# EAGLE design pedalBoard (EAGLE 9.6.2)
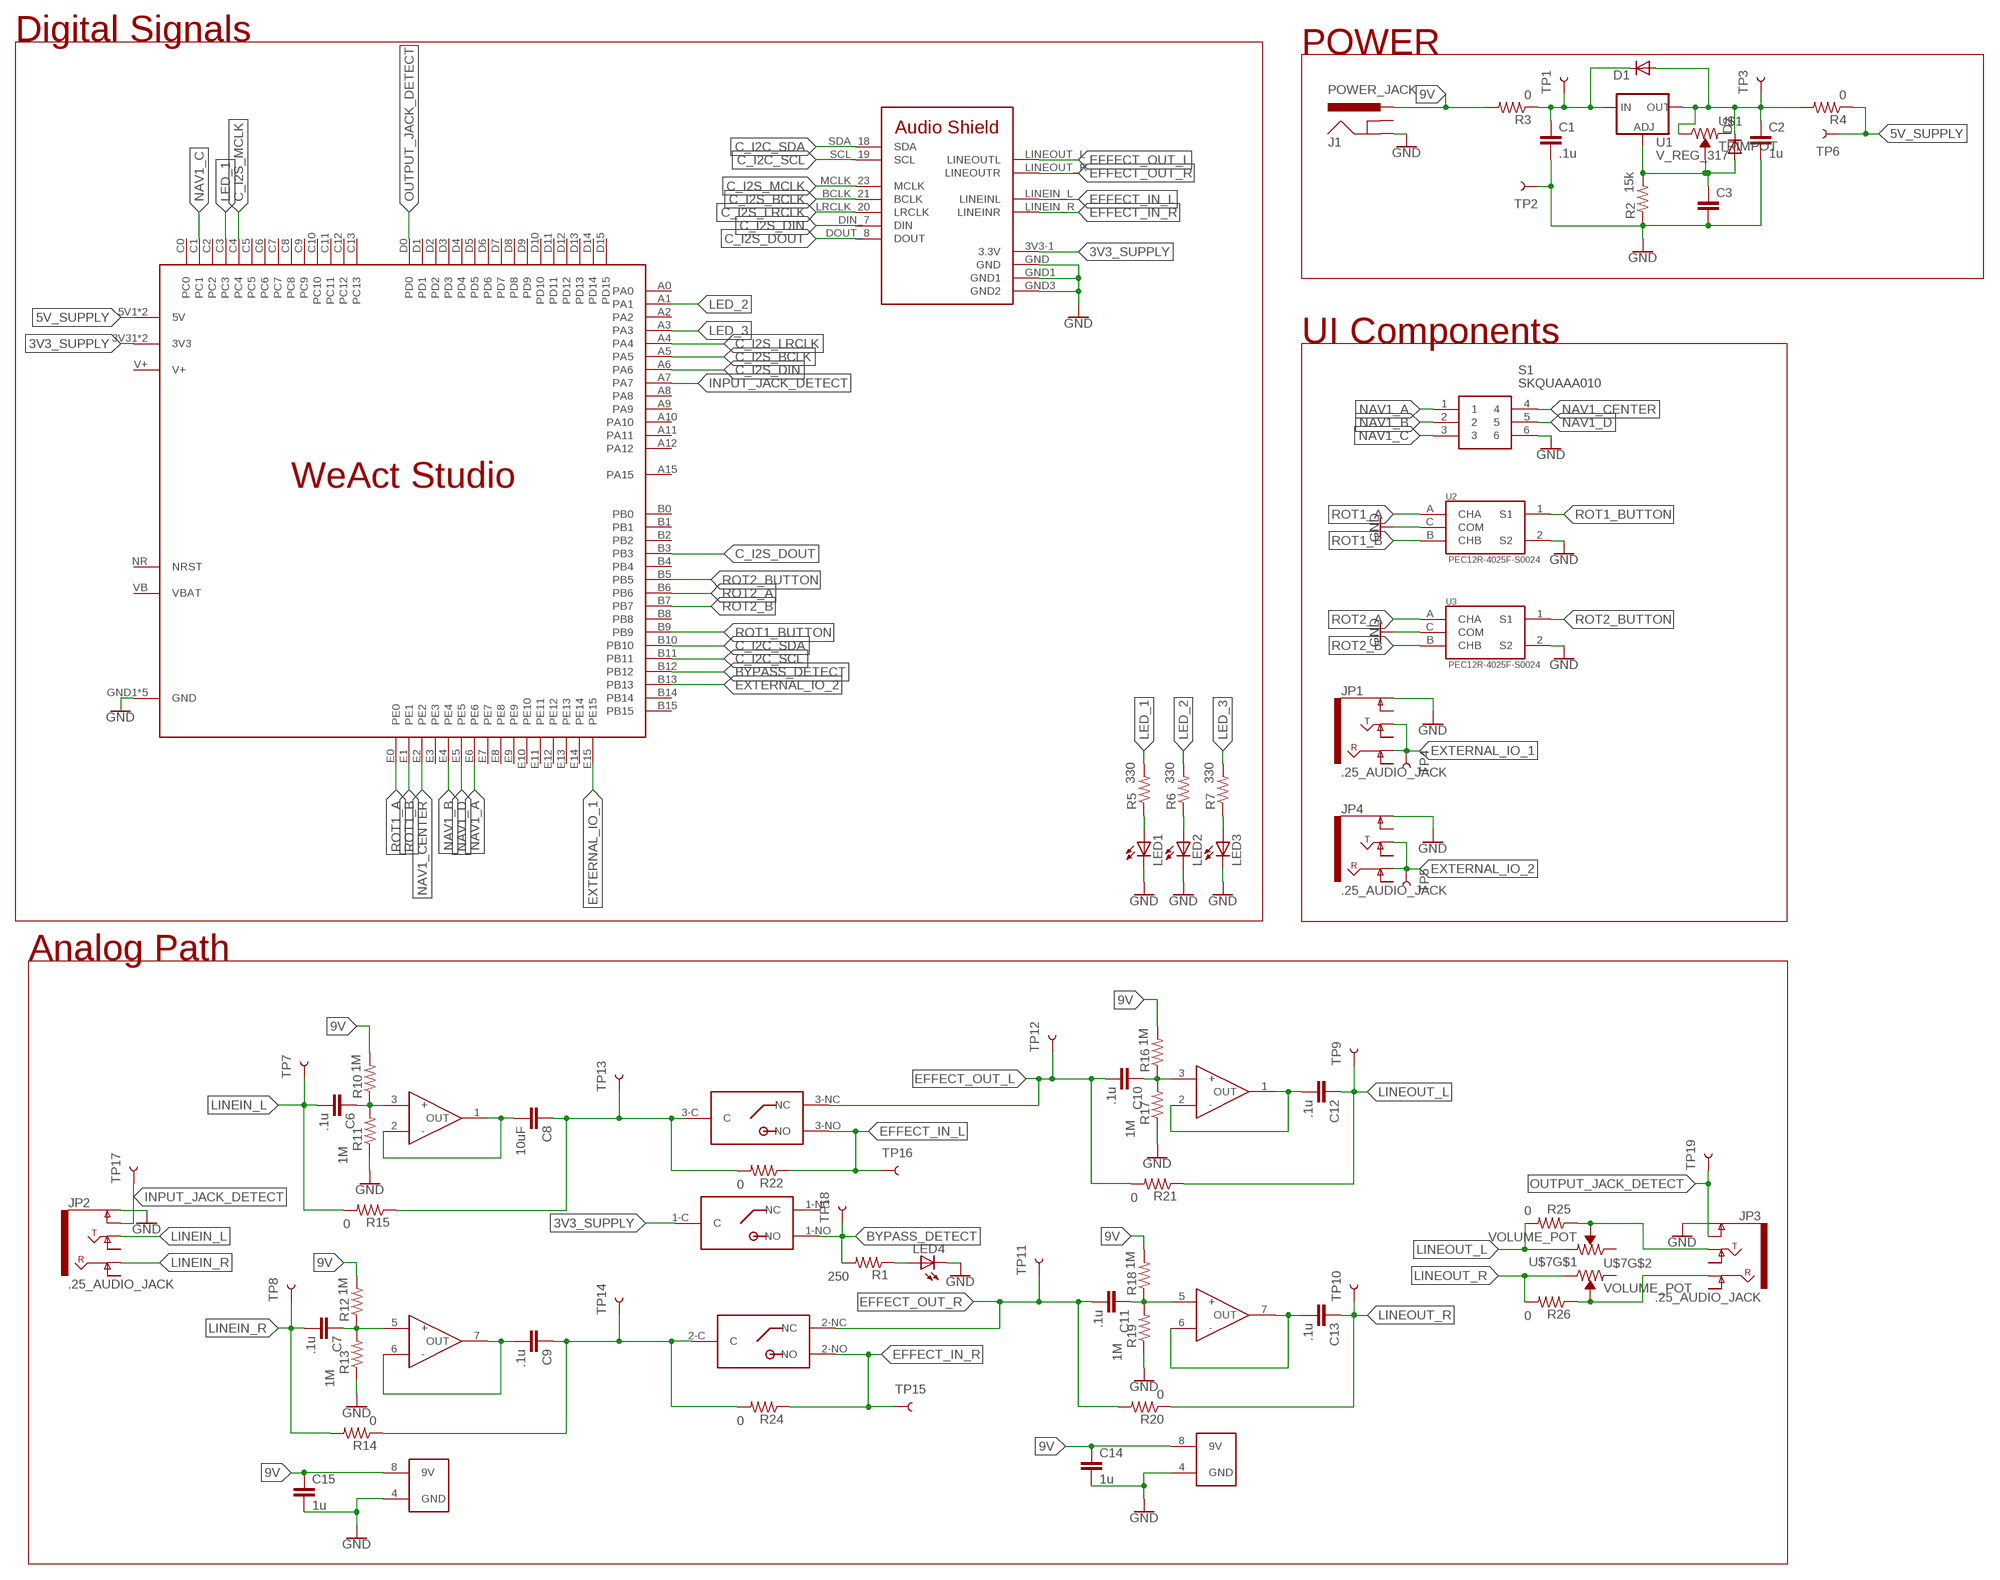
[diagram p0: schematic, sheet 1]

## Parts
C1  .1u  C5/3  [C5B3]
C2  1u  C5/3  [C5B3]
C3  C5/3  [C5B3]
C6  .1u  C5/3  [C5B3]
C7  .1u  C5/3  [C5B3]
C8  10uF  C5/3  [C5B3]
C9  .1u  C5/3  [C5B3]
C10  .1u  C5/3  [C5B3]
C11  .1u  C5/3  [C5B3]
C12  .1u  C5/3  [C5B3]
C13  .1u  C5/3  [C5B3]
C14  1u  C5/3  [C5B3]
C15  1u  C5/3  [C5B3]
D1  1N4004  [DO41-10]
D2  1N4004  [DO41-10]
J1  POWER_JACK  [POWER_JACK_PTH]
JP1  .25_AUDIO_JACK  [SPARKFUN-CONNECTORS_AUDIO-JACK-.25-INCH-HORIZ-PTH]
JP2  .25_AUDIO_JACK  [SPARKFUN-CONNECTORS_AUDIO-JACK-.25-INCH-HORIZ-PTH]
JP3  .25_AUDIO_JACK  [SPARKFUN-CONNECTORS_AUDIO-JACK-.25-INCH-HORIZ-PTH]
JP4  .25_AUDIO_JACK  [SPARKFUN-CONNECTORS_AUDIO-JACK-.25-INCH-HORIZ-PTH]
LED1  LED3MM  [LED3MM]
LED2  LED3MM  [LED3MM]
LED3  LED3MM  [LED3MM]
LED4  LED3MM  [LED3MM]
R1  250  ADAFRUIT_R-US_0309/12  [ADAFRUIT_0309/12]
R2  15k  ADAFRUIT_R-US_0309/12  [ADAFRUIT_0309/12]
R3  0  ADAFRUIT_R-US_0309/12  [ADAFRUIT_0309/12]
R4  0  ADAFRUIT_R-US_0309/12  [ADAFRUIT_0309/12]
R5  330  ADAFRUIT_R-US_0309/12  [ADAFRUIT_0309/12]
R6  330  ADAFRUIT_R-US_0309/12  [ADAFRUIT_0309/12]
R7  330  ADAFRUIT_R-US_0309/12  [ADAFRUIT_0309/12]
R10  1M  ADAFRUIT_R-US_0309/12  [ADAFRUIT_0309/12]
R11  1M  ADAFRUIT_R-US_0309/12  [ADAFRUIT_0309/12]
R12  1M  ADAFRUIT_R-US_0309/12  [ADAFRUIT_0309/12]
R13  1M  ADAFRUIT_R-US_0309/12  [ADAFRUIT_0309/12]
R14  0  ADAFRUIT_R-US_0309/12  [ADAFRUIT_0309/12]
R15  0  ADAFRUIT_R-US_0309/12  [ADAFRUIT_0309/12]
R16  1M  ADAFRUIT_R-US_0309/12  [ADAFRUIT_0309/12]
R17  1M  ADAFRUIT_R-US_0309/12  [ADAFRUIT_0309/12]
R18  1M  ADAFRUIT_R-US_0309/12  [ADAFRUIT_0309/12]
R19  1M  ADAFRUIT_R-US_0309/12  [ADAFRUIT_0309/12]
R20  0  ADAFRUIT_R-US_0309/12  [ADAFRUIT_0309/12]
R21  0  ADAFRUIT_R-US_0309/12  [ADAFRUIT_0309/12]
R22  0  ADAFRUIT_R-US_0309/12  [ADAFRUIT_0309/12]
R24  0  ADAFRUIT_R-US_0309/12  [ADAFRUIT_0309/12]
R25  0  ADAFRUIT_R-US_0309/12  [ADAFRUIT_0309/12]
R26  0  ADAFRUIT_R-US_0309/12  [ADAFRUIT_0309/12]
S1  SKQUAAA010  [SKQUAAA010]
TP1  TEST-POINT3X5  [PAD.03X.05]
TP2  TEST-POINT3X5  [PAD.03X.05]
TP3  TEST-POINT3X5  [PAD.03X.05]
TP4  TEST-POINT3X5  [PAD.03X.05]
TP5  TEST-POINT3X5  [PAD.03X.05]
TP6  TEST-POINT3X5  [PAD.03X.05]
TP7  TEST-POINT3X5  [PAD.03X.05]
TP8  TEST-POINT3X5  [PAD.03X.05]
TP9  TEST-POINT3X5  [PAD.03X.05]
TP10  TEST-POINT3X5  [PAD.03X.05]
TP11  TEST-POINT3X5  [PAD.03X.05]
TP12  TEST-POINT3X5  [PAD.03X.05]
TP13  TEST-POINT3X5  [PAD.03X.05]
TP14  TEST-POINT3X5  [PAD.03X.05]
TP15  TEST-POINT3X5  [PAD.03X.05]
TP16  TEST-POINT3X5  [PAD.03X.05]
TP17  TEST-POINT3X5  [PAD.03X.05]
TP18  TEST-POINT3X5  [PAD.03X.05]
TP19  TEST-POINT3X5  [PAD.03X.05]
U1  V_REG_317  [TO220]
U2  PEC12R-4025F-S0024  [ENC_PEC12R-4025F-S0024]
U3  PEC12R-4025F-S0024  [ENC_PEC12R-4025F-S0024]
U$1  TRIMPOT  [TRIMPOT]
U$2  STOMP_SWITCH  [STOMP_SWITCH]
U$3  AUDIO_SHIELD  [AUDIO_SHIELD]
U$4  WEACT_STUDIO  [WEACT_STUDIO]
U$5  TL072  [8S1]
U$6  TL072  [8S1]
U$7  VOLUME_POT  [2X3]

## Nets
3V3_SUPPLY: U$2.1-C(C) U$3.3V3-1(3.3V) U$4.3V31(3V3) U$4.3V32(3V3)
5V_SUPPLY: R4.1 TP6.P$1 U$4.5V1(5V) U$4.5V2(5V)
9V: C14.1 C15.1 J1.GND(PWR) R3.2 R10.2 R12.2 R16.2 R18.2 U$5.8(9V) U$6.8(9V)
BUFFERED_L: C8.1 R15.1 R22.2 TP13.P$1 U$2.3-C(C)
BUFFERED_R: C9.1 R14.1 R24.2 TP14.P$1 U$2.2-C(C)
BYPASS_DETECT: R1.2 TP18.P$1 U$2.1-NO(NO) U$4.B12
C_I2C_SCL: U$3.SCL_19(SCL) U$4.B11
C_I2C_SDA: U$3.SDA_18(SDA) U$4.B10
C_I2S_BCLK: U$3.BCLK_21(BCLK) U$4.A5
C_I2S_DIN: U$3.DIN_7(DIN) U$4.A6
C_I2S_DOUT: U$3.DOUT_8(DOUT) U$4.B3
C_I2S_LRCLK: U$3.LRCLK_20(LRCLK) U$4.A4
C_I2S_MCLK: U$3.MCLK_23(MCLK) U$4.C4
EFFECT_IN_L: R22.1 TP16.P$1 U$2.3-NO(NO) U$3.LINEIN_L(LINEINL)
EFFECT_IN_R: R24.1 TP15.P$1 U$2.2-NO(NO) U$3.LINEIN_R(LINEINR)
EFFECT_OUT_L: C10.2 R21.2 TP12.P$1 U$2.3-NC(NC) U$3.LINEOUT_L(LINEOUTL)
EFFECT_OUT_R: C11.2 R20.2 TP11.P$1 U$2.2-NC(NC) U$3.LINEOUT_R(LINEOUTR)
EXTERNAL_IO_1: JP1.RING JP1.TIP TP4.P$1 U$4.E15
EXTERNAL_IO_2: JP4.RING JP4.TIP TP5.P$1 U$4.B13
GND: C1.2 C2.2 C3.2 C14.2 C15.2 J1.PWR(GND) JP1.SLEEVE(EARTH) JP2.SLEEVE(EARTH) JP3.SLEEVE(EARTH) JP4.SLEEVE(EARTH) LED1.K(C) LED2.K(C) LED3.K(C) LED4.K(C) R2.1 R11.1 R13.1 R17.1 R19.1 S1.6 TP2.P$1 U2.2(S2) U2.C(COM) U3.2(S2) U3.C(COM) U$3.GND U$3.GND1 U$3.GND3(GND2) U$4.GND1(GND) U$4.GND2(GND) U$4.GND3(GND) U$4.GND4(GND) U$4.GND5(GND) U$5.4(GND) U$6.4(GND)
INPUT_JACK_DETECT: JP2.SLEEVE-NORM(EARTH-NORM) TP17.P$1 U$4.A7
LED_1: R5.2 U$4.C3
LED_2: R6.2 U$4.A1
LED_3: R7.2 U$4.A3
LINEIN_L: C6.2 JP2.TIP R15.2 TP7.P$1
LINEIN_R: C7.2 JP2.RING R14.2 TP8.P$1
LINEOUT_L: C12.1 JP3.TIP R21.1 R25.1 TP9.P$1 U$7.2(WIPER)
LINEOUT_R: C13.1 JP3.RING R20.1 R26.1 TP10.P$1 U$7.5(WIPER)
N$1: LED1.A R5.1
N$3: C1.1 D1.C R3.1 TP1.P$1 U1.3(IN)
N$4: C3.1 D2.A R2.2 U1.1(ADJ) U$1.P$3(WIPER)
N$5: LED2.A R6.1
N$6: LED3.A R7.1
N$7: C2.1 D1.A D2.C R4.2 TP3.P$1 U1.2(OUT) U$1.P$2(CW)
N$8: C7.1 R12.1 R13.2 U$5.5(+)
N$9: C6.1 R10.1 R11.2 U$5.3(+)
N$10: C8.2 U$5.1(OUT) U$5.2(-)
N$11: C10.1 R16.1 R17.2 U$6.3(+)
N$12: C9.2 U$5.6(-) U$5.7(OUT)
N$13: C12.2 U$6.1(OUT) U$6.2(-)
N$14: C11.1 R18.1 R19.2 U$6.5(+)
N$15: C13.2 U$6.6(-) U$6.7(OUT)
N$16: LED4.A R1.1
N$17: R25.2 U$7.1(CCW)
N$18: R26.2 U$7.6(CW)
NAV1_A: S1.1 U$4.E6
NAV1_B: S1.2 U$4.E4
NAV1_C: S1.3 U$4.C1
NAV1_CENTER: S1.4 U$4.E2
NAV1_D: S1.5 U$4.E5
OUTPUT_JACK_DETECT: JP3.SLEEVE-NORM(EARTH-NORM) TP19.P$1 U$4.D0
ROT1_A: U2.A(CHA) U$4.E0
ROT1_B: U2.B(CHB) U$4.E1
ROT1_BUTTON: U2.1(S1) U$4.B9
ROT2_A: U3.A(CHA) U$4.B6
ROT2_B: U3.B(CHB) U$4.B7
ROT2_BUTTON: U3.1(S1) U$4.B5
Unconnected: J1.GNDBREAK JP1.RING-NORM JP1.SLEEVE-NORM(EARTH-NORM) JP1.TIP-NORM JP2.RING-NORM JP2.TIP-NORM JP3.RING-NORM JP3.TIP-NORM JP4.RING-NORM JP4.SLEEVE-NORM(EARTH-NORM) JP4.TIP-NORM U$1.P$1(CCW) U$2.1-NC(NC) U$4.A0 U$4.A2 U$4.A8 U$4.A9 U$4.A10 U$4.A11 U$4.A12 U$4.A15 U$4.B0 U$4.B1 U$4.B2 U$4.B4 U$4.B8 U$4.B14 U$4.B15 U$4.C0 U$4.C2 U$4.C5 U$4.C6 U$4.C7 U$4.C8 U$4.C9 U$4.C10 U$4.C11 U$4.C12 U$4.C13 U$4.D1 U$4.D2 U$4.D3 U$4.D4 U$4.D5 U$4.D6 U$4.D7 U$4.D8 U$4.D9 U$4.D10 U$4.D11 U$4.D12 U$4.D13 U$4.D14 U$4.D15 U$4.E3 U$4.E7 U$4.E8 U$4.E9 U$4.E10 U$4.E11 U$4.E12 U$4.E13 U$4.E14 U$4.NR(NRST) U$4.V+ U$4.VB(VBAT) U$7.3(CW) U$7.4(CCW)

## Notes on the sheet
- Digital Signals
- POWER
- UI Components
- Analog Path

## Library data of the parts
C1-C3 C6-C15 = capacitor-wima:C: CAPACITOR naming: grid - package width
D1 D2 = adafruit:1N4004: DIODE General purpose 1N400x type rectifier (With bigger pads) http://www.ladyada.net/library/pcb/eaglelibrary.html
J1 = digitalEffectPedalLibrary:POWER_JACK: Power Jack Connector This is the standard 5.5mm barrel jack for power. The PTH is the most common, proven, reliable, footprint. The Slot footprint only works if the mill layer is transmitted to the PCB fab house so be warned. Here are the connectors we sell at SparkFun: DC Barrel Power Jack/Connector <https://www.sparkfun.com/products/119> (PRT-00119) DC Barrel Power Jack/Connector (SMD) <https://www.sparkfun.com/products/12748> (PRT-12748) DC Barrel Jack Adapter - Breadboard Compatible <https://www.sparkfun.com/products/10811> (PRT-10811) It is used on this SparkFun product (and many, many others): SparkFun RedBoard - Programmed with Arduino <https://www.sparkfun.com/products/12757> (DEV-12757) Also, if you need a mating power supply or connector, please check these out: Wall Adapter Power Supply - 9VDC 650mA <https://www.sparkfun.com/products/298> (TOL-00298) DC Barrel Jack Adapter - Male <https://www.sparkfun.com/products/10287> (PRT-10287); PROD_ID: CONN-08197
JP1-JP4 = digitalEffectPedalLibrary:.25_AUDIO_JACK: 1/4" TRS jack, horizontal Production SKU: COM-11144 Footprint unproven - datasheet and part seem to be slightly different; PROD_ID: COM-11144
LED1-LED4 = adafruit:LED: LED OSRAM: - CHIPLED LG R971, LG N971, LY N971, LG Q971, LY Q971, LO R971, LY R971 LH N974, LH R974 LS Q976, LO Q976, LY Q976 LO Q996 - Hyper CHIPLED LW Q18S LB Q993, LB Q99A, LB R99A - SideLED LS A670, LO A670, LY A670, LG A670, LP A670 LB A673, LV A673, LT A673, LW A673 LH A674 LY A675 LS A676, LA A676, LO A676, LY A676, LW A676 LS A679, LY A679, LG A679 - Hyper Micro SIDELED® LS Y876, LA Y876, LO Y876, LY Y876 LT Y87S - SmartLED LW L88C, LW L88S LB L89C, LB L89S, LG L890 LS L89K, LO L89K, LY L89K LS L896, LA L896, LO L896, LY L896 - TOPLED LS T670, LO T670, LY T670, LG T670, LP T670 LSG T670, LSP T670, LSY T670, LOP T670, LYG T670 LG T671, LOG T671, LSG T671 LB T673, LV T673, LT T673, LW T673 LH T674 LS T676, LA T676, LO T676, LY T676, LB T676, LH T676, LSB T676, LW T676 LB T67C, LV T67C, LT T67C, LS T67K, LO T67K, LY T67K, LW E67C LS E67B, LA E67B, LO E67B, LY E67B, LB E67C, LV E67C, LT E67C LW T67C LS T679, LY T679, LG T679 LS T770, LO T770, LY T770, LG T770, LP T770 LB T773, LV T773, LT T773, LW T773 LH T774 LS E675, LA E675, LY E675, LS T675 LS T776, LA T776, LO T776, LY T776, LB T776 LHGB T686 LT T68C, LB T68C - Hyper Mini TOPLED® LB M676 - Mini TOPLED Santana® LG M470 LS M47K, LO M47K, LY M47K Source: http://www.osram.convergy.de/
R1-R7 R10-R22 R24-R26 = FinalProject:ADAFRUIT_R-US_: RESISTOR, American symbol
S1 = digitalEffectPedalLibrary:SKQUAAA010: Joystick Switch, 2 axes, 50 mA@ 12 V ac Through Hole 12V dc Source: Datasheet <https://www.mouser.co.uk/datasheet/2/15/skqu-1155891.pdf>; DESCRIPTION: Joystick Switch, 2 axes, 50 mA@ 12 V ac Through Hole 12V dc; HEIGHT: 7.1mm; MANUFACTURER_NAME: ALPS Electric; MANUFACTURER_PART_NUMBER: SKQUAAA010; MOUSER_PART_NUMBER: 688-SKQUAA; MOUSER_PRICE-STOCK: https://www.mouser.com/Search/Refine.aspx?Keyword=688-SKQUAA
TP1-TP19 = SparkFun-Connectors:TEST-POINT: SparkFun Test Points Bare copper test points for troubleshooting or In-Circuit-Testing. These are used by our Production team for verifying production board runs using pogo-pins on test beds. SparkFun Products: SparkFun LSM9DS1 Breakout <https://www.sparkfun.com/products/13284> SparkFun PSOC <https://www.sparkfun.com/products/13714> SparkFun Load Cell Amplifier <https://www.sparkfun.com/products/13879>
U1 = digitalEffectPedalLibrary:V_REG_317: Voltage Regulator Standard LM317 adjustable voltage regulator. AOI (Adjust Output Input). Google 'LM317 Calculator' for easy to use app to get the two resistor values needed. 240/720 for 5V output. 240/390 for 3.3V output. Spark Fun Electronics SKU : COM-00527
U2 U3 = digitalEffectPedalLibrary:PEC12R-4025F-S0024: Encoder 12mm 0detents 20mm Shft Push Momentry Sw 24 Pulse Check availability <https://pricing.snapeda.com/parts/PEC12R-4025F-S0024/Bourns/view-part?ref=eda>; AVAILABILITY: In Stock; DESCRIPTION: Rotary Encoder Mechanical 24 Quadrature (Incremental) Vertical; MF: Bourns; MP: PEC12R-4025F-S0024; PACKAGE: None; PRICE: None; PURCHASE-URL: https://pricing.snapeda.com/search/part/PEC12R-4025F-S0024/?ref=eda
U$1 = digitalEffectPedalLibrary:TRIMPOT
U$2 = digitalEffectPedalLibrary:STOMP_SWITCH
U$3 = digitalEffectPedalLibrary:AUDIO_SHIELD
U$4 = digitalEffectPedalLibrary:WEACT_STUDIO
U$5 U$6 = digitalEffectPedalLibrary:TL072
U$7 = digitalEffectPedalLibrary:VOLUME_POT

## Board
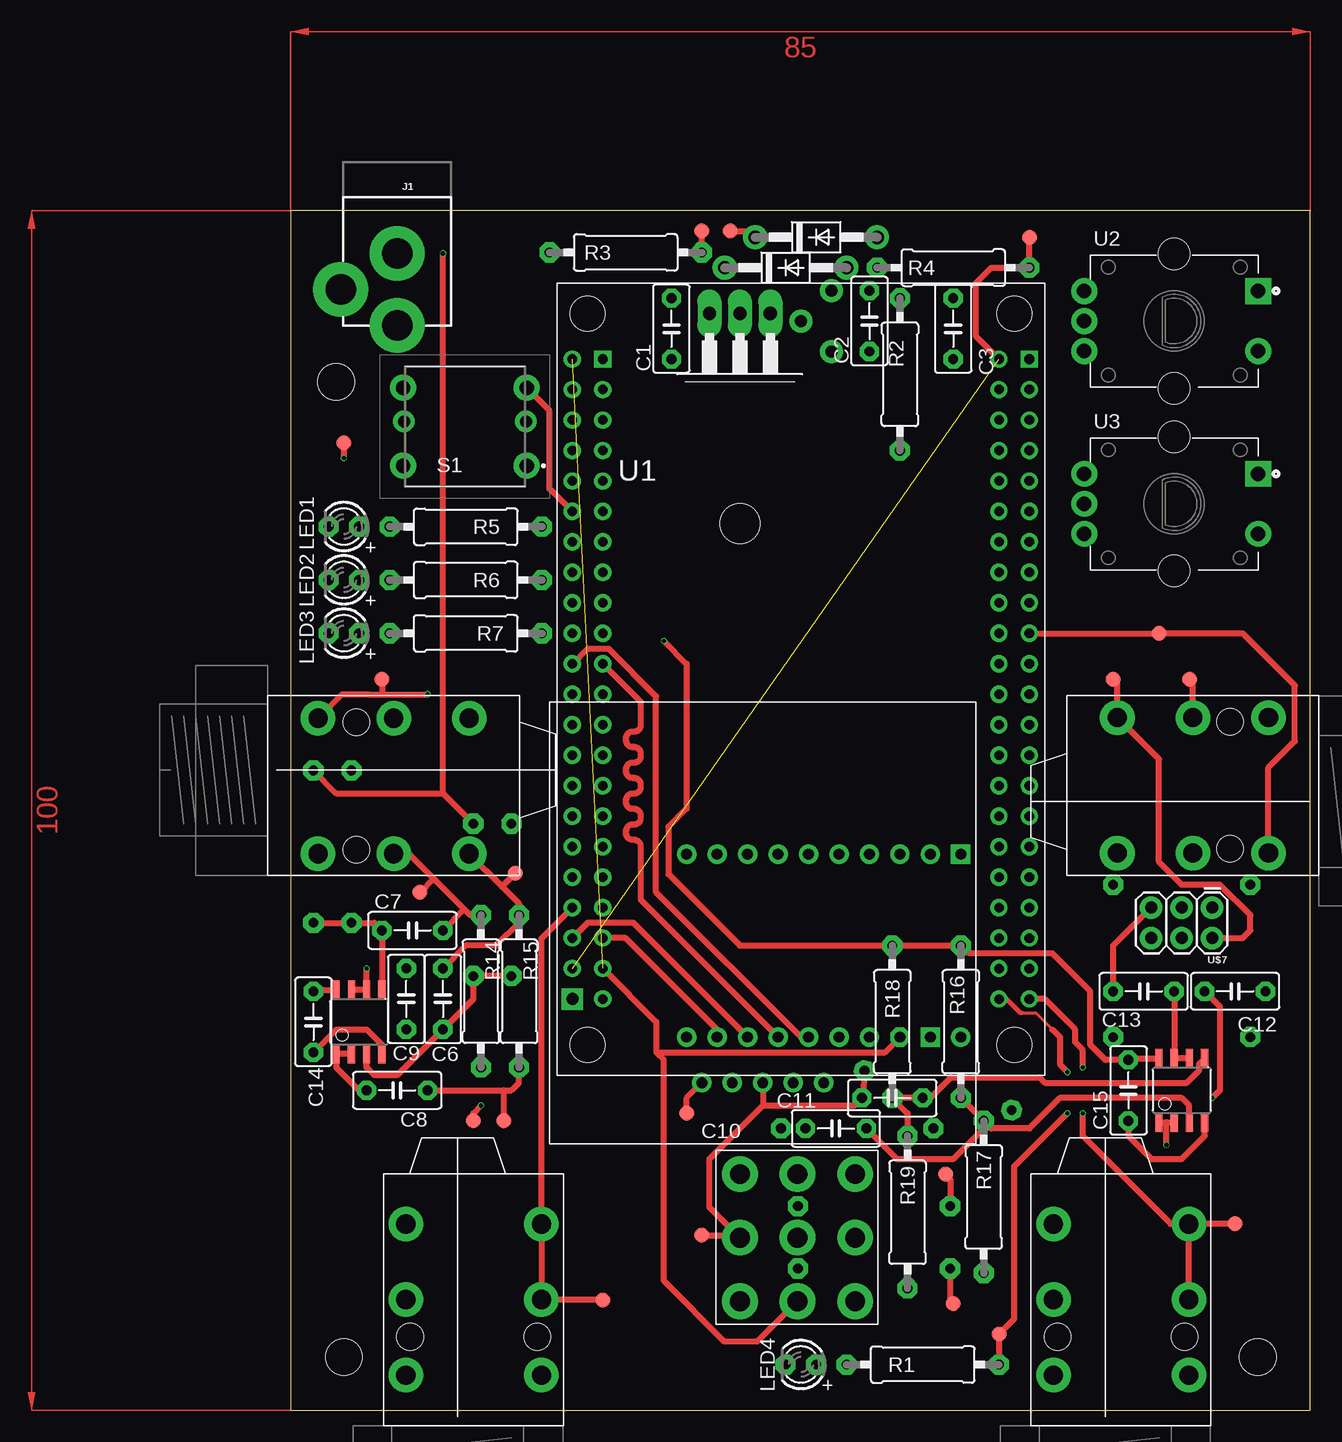
[diagram p1: board, top side]
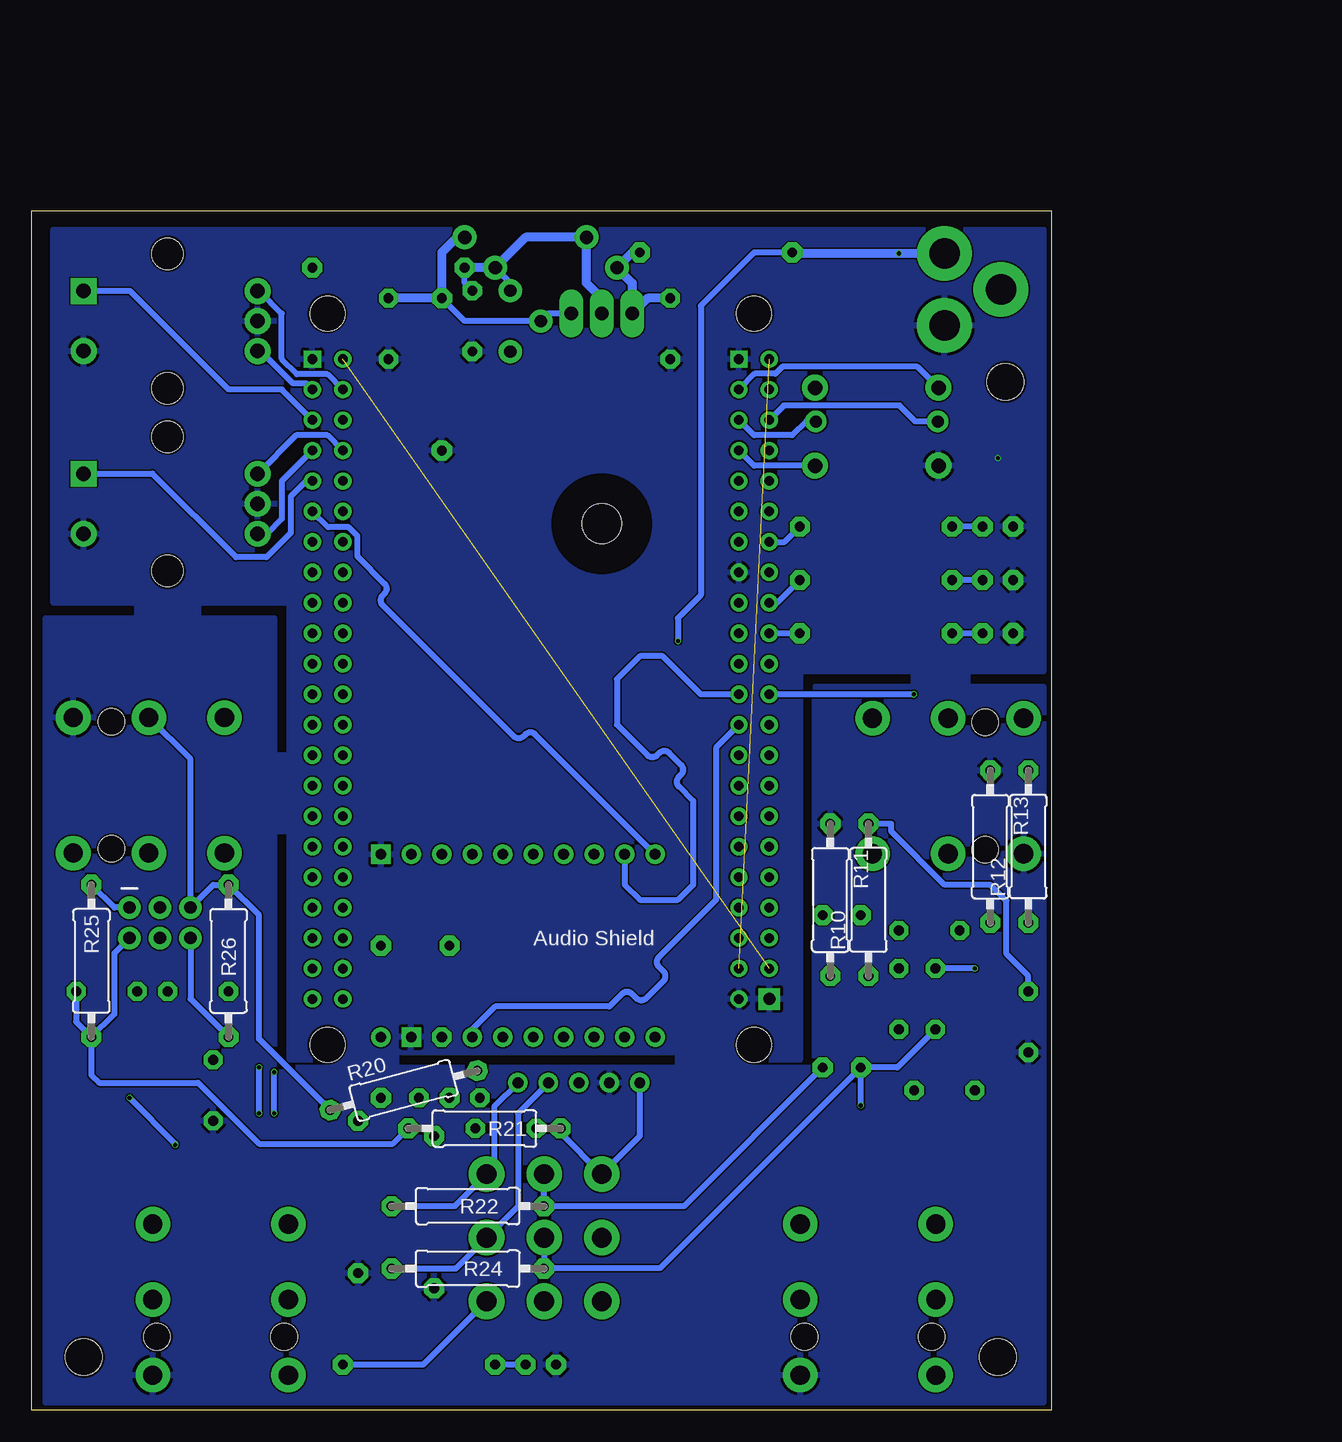
[diagram p2: board, bottom side, seen from below]

Size 85 x 100 mm. Coordinates in mm from the lower left corner, seen from the top.
Outline: 0,0 85,0 85,100 0,100 0,0
Copper layers (1*16): Top 0.035mm / dielectric 1.6mm / Bottom 0.035mm
Design rules "jlcpcb-2layers": minimum track width 5mil, minimum drill 0.3mm, track to track 5mil, track to pad 5mil, pad to pad 5mil, via to via 5mil, smd to smd 5mil, copper to edge 0.2mm, drill to drill 6mil, minimum pad ring 10mil, minimum via ring 3mil, stop-mask expansion 4mil, vias tented up to drill 0mil, thermal gap 10mil
Holes 3.05 mm at 3.81,85.72 4.45,4.45 80.64,4.45

### Footprints (pad centres in the part's own frame; a part is rotated, then mirrored left to right if it is on the bottom)
C5B3 = drill 0.813 pad 1.6 octagon: 1 -2.54,0; 2 2.54,0
DO41-10 = drill 1.118 pad 1.93: A 5.08,0; C -5.08,0
POWER_JACK_PTH = drill 2.54: GND 0,7.7; GNDBREAK 4.7,10.7; PWR 0,13.7
SPARKFUN-CONNECTORS_AUDIO-JACK-.25-INCH-HORIZ-PTH = drill 1.6: RING 10.5,-6.95; RING-NORM 10.5,4.35; SLEEVE 4.2,-6.95; SLEEVE-NORM 4.2,4.35; TIP 16.8,-6.95; TIP-NORM 16.8,4.35 | hole 2.2: 7.4,4; 7.4,-6.6
LED3MM = drill 0.813 pad 1.676 octagon: A -1.27,0; K 1.27,0
ADAFRUIT_0309/12 = drill 0.813 pad 1.676 octagon: 1 -6.35,0; 2 6.35,0
SKQUAAA010 = drill 1.2 pad 1.8: 1 0,0; 3 0,-6.5; 4 10.3,-6.5; 6 10.3,0 | drill 1 pad 1.5: 2 0.07,-3.7; 5 10.23,-3.7
PAD.03X.05 = smd 1.27 x 1.27: P$1 0,0
TO220 = drill 1.118 long: 1 -2.54,-6.35; 2 0,-6.35; 3 2.54,-6.35 | hole 3.302: 0,11.176
ENC_PEC12R-4025F-S0024 = drill 1.2 pad 1.8 square: 1 7,2.5 | drill 1.2 pad 1.8: 2 7,-2.5; A -7.5,2.5; B -7.5,-2.5; C -7.5,0 | hole 2.6: 0,5.6; 0,-5.6
TRIMPOT = drill 1.016 pad 1.93: P$1 0,0; P$2 5.08,0; P$3 2.54,2.54
STOMP_SWITCH = drill 1.651: 1-C 7.34,2.1; 1-NC 2.54,2.1; 1-NO 12.14,2.1; 2-C 7.34,7.4; 2-NC 2.54,7.4; 2-NO 12.14,7.4; 3-C 7.34,12.7; 3-NC 2.54,12.7; 3-NO 12.14,12.7
AUDIO_SHIELD = drill 0.9: 0 -12.7,17.78; 1 -10.16,17.78; 2 -7.62,17.78; 3 -5.08,17.78; 4 -2.54,17.78; 5 0,17.78; 5V -15.24,2.54; 6 2.54,17.78; 17 7.62,2.54; 22 -5.08,2.54; BCLK_21 -2.54,2.54; DIN_7 5.08,17.78; DOUT_8 7.62,17.78; GND 3.81,-1.27; LINEIN_L -3.81,-1.27; LINEIN_R -1.27,-1.27; LINEOUT_L 6.35,-1.27; LINEOUT_R 1.27,-1.27; LRCLK_20 0,2.54; MCLK_23 -7.62,2.54; SCL_19 2.54,2.54; SDA_18 5.08,2.54 | drill 0.9 octagon: 3V3-1 -10.16,2.54 | drill 0.9 square: GND1 -15.24,17.78; GND3 -12.7,2.54
WEACT_STUDIO = drill 0.8 pad 1.422: 3V31 -38.1,7.62; 3V32 -35.56,-43.18; 5V1 -2.54,7.62; 5V2 -38.1,-43.18; A0 -35.56,-12.7; A1 -38.1,-12.7; A2 -35.56,-15.24; A3 -38.1,-15.24; A4 -35.56,-17.78; A5 -38.1,-17.78; A6 -35.56,-20.32; A7 -38.1,-20.32; A8 -2.54,-25.4; A9 0,-25.4; A10 -2.54,-22.86; A11 0,-22.86; A12 -2.54,-20.32; A15 0,-20.32; B0 -35.56,-25.4; B1 -38.1,-25.4; B2 -35.56,-27.94; B3 0,-5.08; B4 -2.54,-2.54; B5 0,-2.54; B6 -2.54,0; B7 0,0; B8 -2.54,2.54; B9 0,2.54; B10 -35.56,-40.64; B11 -38.1,-40.64; B12 -2.54,-45.72; B13 0,-45.72; B14 -2.54,-43.18; B15 0,-43.18; C0 -35.56,-5.08; C1 -38.1,-5.08; C2 -35.56,-7.62; C3 -38.1,-7.62; C4 -35.56,-22.86; C5 -38.1,-22.86; C6 -2.54,-30.48; C7 0,-30.48; C8 -2.54,-27.94; C9 0,-27.94; C10 -2.54,-17.78; C11 0,-17.78; C12 -2.54,-15.24; C13 -35.56,-2.54; D0 0,-15.24; D1 -2.54,-12.7; D2 0,-12.7; D3 -2.54,-10.16; D4 0,-10.16; D5 -2.54,-7.62; D6 0,-7.62; D7 -2.54,-5.08; D8 -2.54,-40.64; D9 0,-40.64; D10 -2.54,-38.1; D11 0,-38.1; D12 -2.54,-35.56; D13 0,-35.56; D14 -2.54,-33.02; D15 0,-33.02; E0 -2.54,5.08; E1 0,5.08; E2 -35.56,5.08; E3 -38.1,5.08; E4 -35.56,2.54; E5 -38.1,2.54; E6 -35.56,0; E7 -38.1,-27.94; E8 -35.56,-30.48; E9 -38.1,-30.48; E10 -35.56,-33.02; E11 -38.1,-33.02; E12 -35.56,-35.56; E13 -38.1,-35.56; E14 -35.56,-38.1; E15 -38.1,-38.1; GND4 -35.56,-45.72; GND5 -35.56,-10.16; NR -38.1,-2.54; V+ -38.1,-10.16; VB -38.1,0 | drill 0.8 square: GND1 0,7.62; GND2 -35.56,7.62 | drill 1 square: GND3 -38.1,-45.72 | hole 2.9: -36.83,11.43; -1.27,11.43; -1.27,-49.53; -36.83,-49.53
8S1 = smd 0.6 x 1.6: 1 -1.905,-2.654; 2 -0.645,-2.654; 3 0.625,-2.654; 4 1.895,-2.654; 5 1.905,2.654; 6 0.635,2.654; 7 -0.635,2.654; 8 -1.905,2.654
2X3 = drill 1.016 pad 1.88: 1 0,0; 2 0,2.54; 3 2.54,0; 4 2.54,2.54; 5 5.08,0; 6 5.08,2.54

### Placement (x,y rotation side)
C1  31.75,90.17 270 top
C2  48.26,90.81 270 top
C3  55.24,90.17 270 top
C6  12.7,34.29 90 top
C7  10.16,40.01 0 top
C8  8.89,26.67 180 top
C9  9.65,34.29 90 top
C10  45.47,23.5 180 top
C11  50.16,26.04 180 top
C12  78.74,34.92 180 top
C13  71.12,34.92 0 top
C14  1.91,32.38 270 top
C15  69.85,26.67 270 top
D1  41.27,95.25 0 top
D2  43.81,97.79 0 top
J1  8.89,104.14 180 top
JP1  13.97,-1.27 90 top
JP2  -1.91,53.34 0 top
JP3  85.72,50.8 180 top
JP4  67.94,-1.27 90 top
LED1  4.45,73.66 180 top
LED2  4.45,69.22 180 top
LED3  4.45,64.77 180 top
LED4  42.55,3.81 180 top
R1  52.7,3.81 0 top
R2  50.8,86.36 90 top
R3  27.94,96.52 180 top
R4  55.24,95.25 180 top
R5  14.61,73.66 0 top
R6  14.61,69.22 0 top
R7  14.61,64.77 0 top
R10  15.24,42.55 90 bottom
R11  18.41,42.55 270 bottom
R12  1.91,46.99 90 bottom
R13  5.08,46.99 270 bottom
R14  15.88,34.92 90 top
R15  19.05,34.92 90 top
R16  55.88,32.38 90 top
R17  57.78,17.78 90 top
R18  50.16,32.38 90 top
R19  51.44,16.51 90 top
R20  53.98,26.67 15 bottom
R21  47.24,23.5 0 bottom
R22  48.64,17.02 0 bottom
R24  48.64,11.81 0 bottom
R25  80.01,37.47 90 bottom
R26  68.58,37.47 270 bottom
S1  19.68,78.74 180 top
TP1  34.29,98.3 0 top
TP2  4.45,80.64 0 top
TP3  36.64,98.3 0 top
TP4  26.04,9.21 0 top
TP5  78.74,15.56 0 top
TP6  61.59,97.79 0 top
TP7  18.73,44.77 0 top
TP8  10.79,43.18 0 top
TP9  68.58,60.96 0 top
TP10  74.93,60.96 0 top
TP11  34.29,14.61 0 top
TP12  33.02,24.77 0 top
TP13  17.78,24.13 0 top
TP14  15.24,24.13 0 top
TP15  55.24,8.89 0 top
TP16  54.61,19.68 0 top
TP17  7.62,60.96 0 top
TP18  59.05,6.35 0 top
TP19  72.39,64.77 0 top
U1  37.47,85.09 180 top
U2  73.66,90.81 0 top
U3  73.66,75.56 0 top
U$1  45.09,88.27 90 top
U$2  34.92,6.99 0 top
U$3  40.64,28.57 0 bottom
U$4  61.59,80.01 0 top
U$5  5.71,32.38 0 top
U$6  74.3,26.67 0 top
U$7  76.83,41.91 180 top

### Tracks (layer width: path | path; a pad name or v marks a point on that pad's centre or on a via)
3V3_SUPPLY  (1 unrouted)
  Top 0.508: U$4.3V32 30.48,32.38 30.48,29.84 | 30.48,29.84 31.11,29.21 31.11,10.79 36.2,5.71 38.9,5.71 U$2.1-C | 30.48,29.84 49.53,29.84 U$3.3V3-1
5V_SUPPLY  (1 unrouted)
  Top 0.508: TP6.P$1 R4.1 58.42,95.25 57.15,93.98 57.15,89.53 U$4.5V1
9V  (via drill 0.35)
  Top 0.508: C14.1 2.02,35.04 U$5.8 | R10.2 12.7,51.44 | 12.7,51.44 v12.7,96.44 | R12.2 3.81,51.44 12.7,51.44 | v31.11,64.14 33.02,62.23 33.02,50.16 31.5,48.64 31.5,44.7 37.47,38.73 R18.2 R16.2 56.52,38.1 63.5,38.1 66.67,34.92 66.67,30.48 67.94,29.21 C15.1 69.96,29.32 U$6.8
  Bottom 0.508: C14.1 1.91,36.2 3.73,38.02 3.73,42.47 5.08,43.81 8.89,43.81 13.34,48.26 13.34,48.9 R10.2 | R3.2 24.77,96.52 29.21,92.08 29.21,67.94 31.11,66.04 v31.11,64.14
  Bottom 0.762: J1.GND v12.7,96.44 21.51,96.44 R3.2
BUFFERED_L
  Top 0.508: C8.1 17.78,26.67 | 17.78,26.67 18.41,26.67 19.05,27.3 R15.1 | TP13.P$1 17.78,26.67
  Bottom 0.508: U$2.3-C 42.29,19.66 R22.2 30.61,17.02 R15.1
BUFFERED_R  (via drill 0.35)
  Top 0.508: TP14.P$1 15.24,24.77 v15.88,25.4
  Bottom 0.508: U$2.2-C 42.27,11.84 | 42.27,11.84 R24.2 | C9.1 12.83,28.57 R14.1 | R14.1 32.61,11.84 42.27,11.84 | v15.88,25.4 R14.1
BYPASS_DETECT  (via drill 0.35)
  Top 0.254: 60.96,33.14 62.11,33.14 63.5,31.75
  Top 0.381: U$4.B12 59.69,34.29 60.84,33.14 60.96,33.14
  Top 0.508: R1.2 TP18.P$1 60.33,7.62 60.33,20.32 v64.77,24.77 | 63.5,31.75 64.14,31.11 64.14,28.83 v64.77,28.19
  Bottom 0.508: U$2.1-NO 52.34,3.81 R1.2 | v64.77,24.77 v64.77,28.19
C_I2C_SCL
  Top 0.508: U$3.SCL_19 28.57,40.64 24.77,40.64 U$4.B11
C_I2C_SDA
  Top 0.508: U$3.SDA_18 35.56,31.75 27.94,39.37 U$4.B10
C_I2S_BCLK
  Top 0.508: U$4.A5 24.77,63.5 26.49,63.5 30.48,59.51 30.48,43.18 42.55,31.11 U$3.BCLK_21
C_I2S_DIN
  Bottom 0.508: U$3.DIN_7 35.56,43.81 34.29,42.55 31.11,42.55 29.84,43.81 29.84,50.8 31.03,51.99 arc90 31.03,52.8 30.84,52.99 arc-90 30.84,53.8 31.85,54.8 arc-90 32.66,54.8 32.85,54.61 arc90 33.66,54.61 36.2,57.15 36.2,60.96 34.29,62.87 32.38,62.87 29.21,59.69 U$4.A6
C_I2S_DOUT
  Bottom 0.508: U$3.DOUT_8 43.01,56.35 arc-90 43.82,56.35 43.99,56.19 arc90 44.8,56.19 55.73,67.12 arc90 55.73,67.92 55.56,68.09 arc-90 55.56,68.9 57.84,71.17 57.84,72.89 58.55,73.61 60.27,73.61 U$4.B3
C_I2S_LRCLK
  Top 0.508: U$3.LRCLK_20 29.21,42.55 29.21,46.98 arc90 28.64,47.55 28.54,47.55 arc-90 27.97,48.12 27.97,48.27 arc-90 28.54,48.84 28.64,48.84 arc90 29.21,49.41 29.21,49.56 arc90 28.64,50.13 28.54,50.13 arc-90 27.97,50.7 27.97,50.85 arc-90 28.54,51.42 28.64,51.42 arc90 29.21,51.99 29.21,52.14 arc90 28.64,52.71 28.54,52.71 arc-90 27.97,53.28 27.97,53.43 arc-90 28.54,54 28.64,54 arc90 29.21,54.57 29.21,54.72 arc90 28.64,55.29 28.54,55.29 arc-90 27.97,55.86 27.97,56.01 arc-90 28.54,56.58 28.64,56.58 arc90 29.21,57.15 29.21,59.05 U$4.A4
C_I2S_MCLK
  Bottom 0.508: U$4.C4 27.94,55.24 27.94,42.55 32.7,37.78 arc-90 32.7,36.97 32.33,36.6 arc90 32.33,35.79 33.77,34.35 arc90 34.57,34.35 34.95,34.73 arc-90 35.76,34.73 36.83,33.66 46.35,33.66 48.26,31.75 U$3.MCLK_23
EFFECT_IN_L
  Top 0.508: TP16.P$1 54.99,19.3 R22.1
  Bottom 0.508: R22.1 49.73,17.02 U$2.3-NO 46.43,20.32 46.43,25.32 U$3.LINEIN_L
EFFECT_IN_R
  Top 0.508: TP15.P$1 54.99,9.14 R24.1
  Bottom 0.508: R24.1 49.64,11.81 U$2.2-NO 44.45,17 44.45,24.77 U$3.LINEIN_R
EFFECT_OUT_L
  Top 0.508: TP12.P$1 33.02,26.04 U$3.LINEOUT_L
  Bottom 0.508: U$3.LINEOUT_L 34.29,22.86 U$2.3-NC 40.89,23.11 R21.2 C10.2
EFFECT_OUT_R
  Top 0.508: U$3.LINEOUT_R 39.37,25.4 | 39.37,25.4 34.92,20.95 34.92,16.93 U$2.2-NC 37.24,14.61 TP11.P$1 | 39.37,25.4 46.99,25.4 C11.2 47.71,26.12 R20.2
EXTERNAL_IO_1
  Top 0.508: U$4.E15 20.92,39.34 JP1.TIP JP1.RING 20.94,9.21 TP4.P$1
EXTERNAL_IO_2  (via drill 0.35)
  Top 0.508: JP4.TIP 73.37,15.53 66.04,22.86 v66.04,24.77 | JP4.RING JP4.TIP | v66.04,28.57 66.04,30.04 65.41,30.67 65.41,31.75 62.87,34.29 U$4.B13 | TP5.P$1 78.71,15.53 JP4.TIP
  Bottom 0.508: v66.04,24.77 v66.04,28.57
GND  (via drill 0.35)
  Top 0.508: C14.2 3.81,31.75 6.35,31.75 7.62,30.48 U$5.4 | C15.2 69.85,22.86 71.75,20.95 74.3,20.95 76.2,22.86 76.2,24.01 U$6.4 | TP2.P$1 v4.45,79.38
  pour Bottom: 0.64,0.64 83.82,0.64 83.82,66.04 64.77,66.04 64.77,28.57 19.68,28.57 19.68,60.33 0.64,60.33
  pour Bottom: 0.64,98.42 0.64,61.59 6.99,61.59 6.99,59.69 11.43,59.69 11.43,61.59 20.95,61.59 20.95,29.21 24.77,29.21 24.77,26.67 31.11,26.67 31.11,29.84 54.61,29.84 54.61,27.3 60.33,27.3 60.33,29.21 63.5,29.21 63.5,48.26 65.41,48.26 65.41,54.61 63.5,54.61 63.5,67.31 71.12,67.31 71.12,65.41 76.2,65.41 76.2,67.31 83.19,67.31 83.19,98.42
INPUT_JACK_DETECT  (via drill 0.35)
  Top 0.508: 7.62,59.69 6.5,59.69 6.48,59.71 4.32,59.71 JP2.SLEEVE-NORM | 7.62,59.69 v11.43,59.69 | TP17.P$1 7.62,59.69
  Bottom 0.508: v11.43,59.69 U$4.A7
LED_1
  Bottom 0.508: U$4.C3 22.23,72.39 R5.2
LED_2
  Bottom 0.508: U$4.A1 22.86,67.31 R6.2
LED_3
  Bottom 0.508: R7.2 U$4.A3
LINEIN_L
  Top 0.508: JP2.TIP 17.62,43.66 | 17.62,43.66 19.05,42.23 R15.2 19.05,40.64 17.14,38.73 14.61,38.73 C6.2 | TP7.P$1 17.62,43.66
LINEIN_R
  Top 0.508: JP2.RING 9.87,46.39 11.94,44.32 | 14.47,41.78 14.98,41.27 R14.2 | 14.47,41.78 11.94,44.32 | C7.2 14.47,41.78 | TP8.P$1 11.94,44.32
LINEOUT_L
  Top 0.508: U$7.2 79.38,39.37 80.01,40.01 80.01,41.27 77.47,43.81 74.3,43.81 72.39,45.72 72.39,54.28 JP3.TIP 68.92,60.62 TP9.P$1
  Bottom 0.508: R25.1 78.11,33.02 78.11,38.1 U$7.2 | R21.1 54.86,22.23 66.04,22.23 71.12,27.3 79.38,27.3 80.01,27.94 R25.1 | C12.1 81.28,32.38 R25.1
LINEOUT_R
  Top 0.508: C13.1 68.58,38.73 U$7.5 | JP3.RING 75.22,60.66 TP10.P$1
  Bottom 0.508: R20.1 66.04,30.96 66.04,41.27 R26.1 69.85,43.81 U$7.5 71.75,54.28 JP3.RING
N$1
  Bottom 0.508: LED1.A R5.1
N$3
  Top 0.508: R3.1 TP1.P$1
  Bottom 0.762: R3.1 34.92,96.52 D1.C 34.92,93.98 U1.3 33.66,92.71 C1.1
N$4
  Bottom 0.508: U1.1 41.91,91.44 U$1.P$3 48.9,90.81 R2.2
  Bottom 0.762: D2.A 49.53,97.79 50.8,96.52 R2.2 C3.1
N$5
  Bottom 0.508: LED2.A R6.1
N$6
  Bottom 0.508: LED3.A R7.1
N$7
  Top 0.508: TP3.P$1 38.23,98.3 D2.C
  Bottom 0.508: C2.1 48.9,93.98 R4.2 | U$1.P$2 45.09,93.98 D1.A
  Bottom 0.762: U1.2 37.47,92.71 38.73,93.98 D2.C 43.81,97.79 D1.A R4.2
N$8
  Top 0.508: U$5.5 C7.1 6.99,40.64 R13.2 R12.1
N$9
  Top 0.508: U$5.3 6.34,28.59 6.99,27.94 8.89,27.94 C6.1 15.24,34.29 R10.1 R11.2
N$10
  Top 0.508: U$5.2 U$5.1 3.81,28.57 5.71,26.67 C8.2
N$11
  Top 0.508: R16.1 R17.2 | C10.1 50.55,20.95 55.24,20.95 57.78,23.5 R17.2 | U$6.3 74.92,25.41 74.3,26.04 64.14,26.04 61.59,23.5 58.42,23.5 R17.2
N$12  (via drill 0.35)
  Top 0.508: U$5.7 U$5.6 v6.35,36.83
  Bottom 0.508: v6.35,36.83 C9.2
N$13  (via drill 0.35)
  Top 0.508: C12.2 77.47,33.66 77.47,26.67 v76.83,26.04 | U$6.1 73.03,24.02 | 73.03,24.02 U$6.2 | v73.03,22.11 73.03,24.02
  Bottom 0.508: v76.83,26.04 73.03,22.23 v73.03,22.11
N$14
  Top 0.508: R19.2 51.44,24.77 R18.1 C11.1 53.34,26.04 55.06,27.76 62.41,27.76 62.87,27.3 74.73,27.3 75.74,28.31 75.74,28.86 U$6.5
N$15
  Top 0.508: U$6.6 U$6.7 C13.2
N$16
  Bottom 0.508: LED4.A R1.1
N$17
  Bottom 0.508: R25.2 78.11,41.91 U$7.1
N$18
  Bottom 0.508: U$7.6 71.75,34.29 R26.2
NAV1_A
  Bottom 0.508: S1.1 24.77,78.74 U$4.E6
NAV1_B
  Bottom 0.508: S1.2 20.43,82.44 21.59,81.28 24.77,81.28 U$4.E4
NAV1_C
  Top 0.508: S1.3 21.59,83.33 21.59,76.83 U$4.C1
NAV1_CENTER
  Bottom 0.508: S1.4 11.14,87 22.41,87 22.99,86.41 24.71,86.41 U$4.E2
NAV1_D
  Bottom 0.508: S1.5 11.32,82.44 12.64,83.76 22.29,83.76 U$4.E5
OUTPUT_JACK_DETECT
  Top 0.508: JP3.SLEEVE-NORM 81.53,53.59 83.73,55.79 83.73,60.41 79.38,64.77 TP19.P$1 U$4.D0
ROT1_A
  Bottom 0.508: U$4.E0 60.33,86.36 62.87,86.36 64.14,87.63 64.14,91.44 66,93.31 U2.A
ROT1_B
  Bottom 0.508: U$4.E1 62.1,85.6 63.18,85.6 65.89,88.31 U2.B
ROT1_BUTTON
  Bottom 0.508: U$4.B9 64.14,85.09 68.58,85.09 76.8,93.31 U2.1
ROT2_A
  Bottom 0.508: U$4.B6 60.33,81.28 62.95,81.28 U3.A
ROT2_B
  Bottom 0.508: U$4.B7 64.14,77.47 64.14,74.3 65.36,73.06 U3.B
ROT2_BUTTON
  Bottom 0.508: U3.1 80.62,78.11 74.93,78.11 67.94,71.12 65.41,71.12 63.37,73.15 63.37,76.2 62.1,77.47 U$4.B5
(copper drawn outside any net)
  shapes: Top area x2